# Altium schematic sheet theMonarchTransmitter.SchDoc: The Monarch Receiver
size A4; DrawnBy: Madison Beare
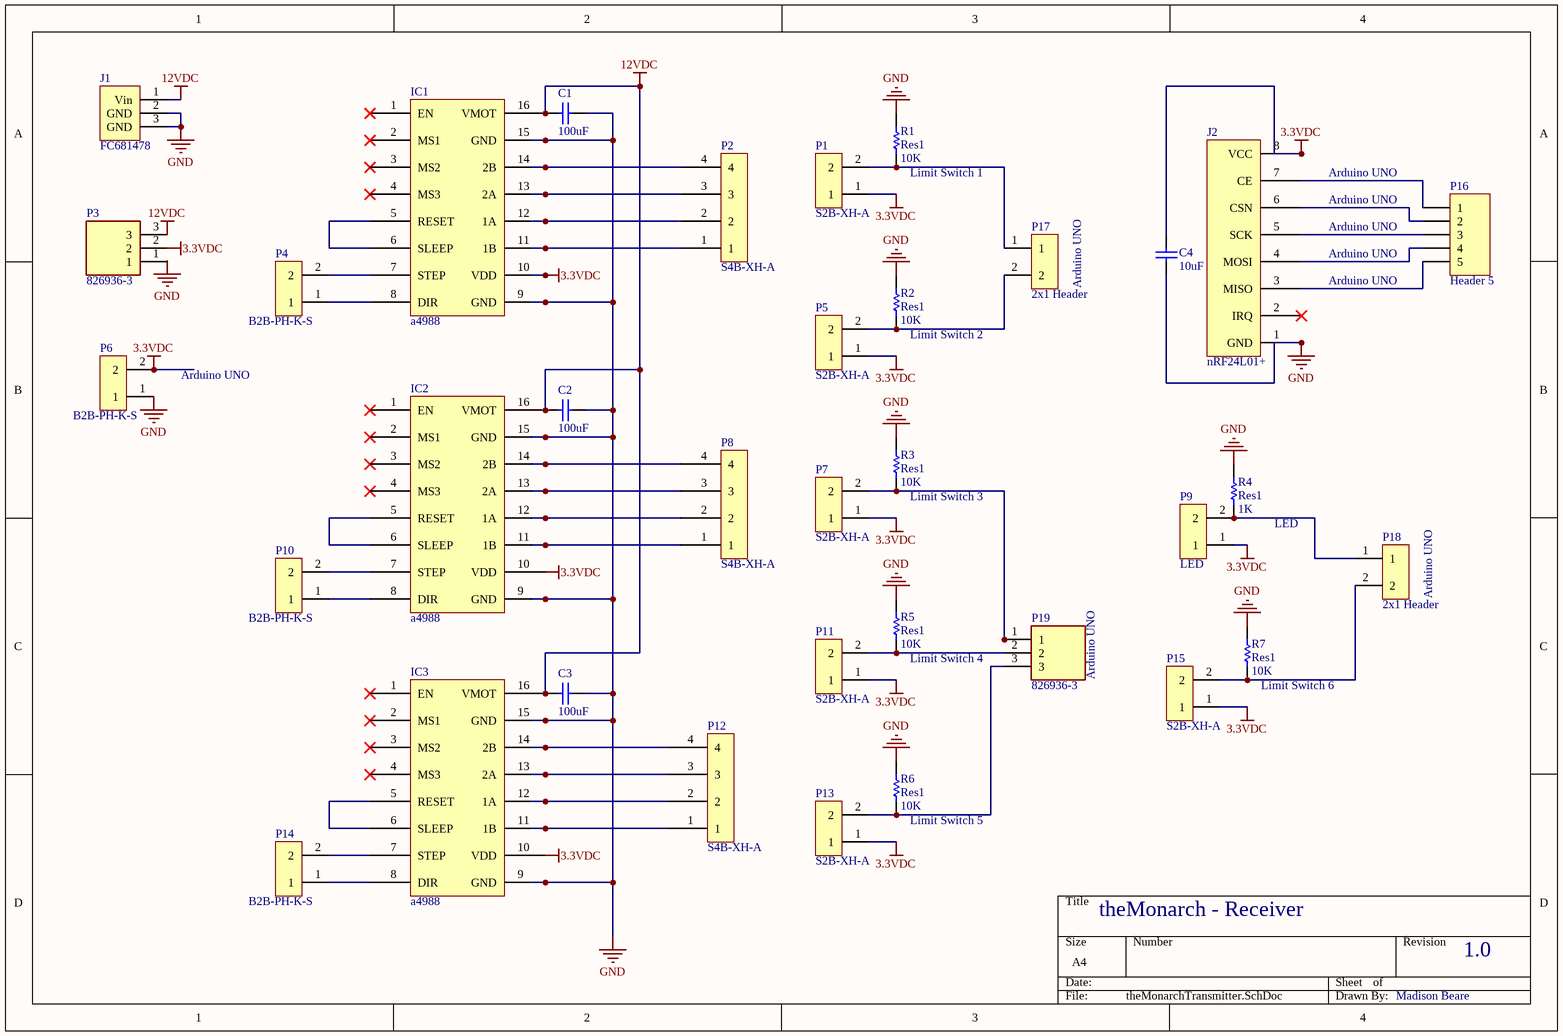
[diagram p0: theMonarchTransmitter.SchDoc]

## Parts
C1  100uF  [RAD-0.3]
C2  100uF  [RAD-0.3]
C3  100uF  [RAD-0.3]
C4  10uF  [RAD-0.3]
IC1  a4988  [MODULE_A4988_STEPPER_MOTOR_DRIVER_CARRIER]
IC2  a4988  [MODULE_A4988_STEPPER_MOTOR_DRIVER_CARRIER]
IC3  a4988  [MODULE_A4988_STEPPER_MOTOR_DRIVER_CARRIER]
J1  FC681478  [FC681478]
J2  nRF24L01+  [TE_5-146278-8]
P1  S2B-XH-A  [JST_S2B-XH-A(LF)(SN)]
P2  S4B-XH-A  [S4B-XH-A(LF)(SN)]
P3  826936-3  [TE_826936-3]
P4  B2B-PH-K-S  [JST_B2B-PH-K-S(LF)(SN)]
P5  S2B-XH-A  [JST_S2B-XH-A(LF)(SN)]
P6  B2B-PH-K-S  [JST_B2B-PH-K-S(LF)(SN)]
P7  S2B-XH-A  [JST_S2B-XH-A(LF)(SN)]
P8  S4B-XH-A  [S4B-XH-A(LF)(SN)]
P9  LED  [HDR1X2]
P10  B2B-PH-K-S  [JST_B2B-PH-K-S(LF)(SN)]
P11  S2B-XH-A  [JST_S2B-XH-A(LF)(SN)]
P12  S4B-XH-A  [S4B-XH-A(LF)(SN)]
P13  S2B-XH-A  [JST_S2B-XH-A(LF)(SN)]
P14  B2B-PH-K-S  [JST_B2B-PH-K-S(LF)(SN)]
P15  S2B-XH-A  [JST_S2B-XH-A(LF)(SN)]
P16  Header 5  [HDR1X5]
P17  2x1 Header  [JST_B2B-PH-K-S(LF)(SN)]
P18  2x1 Header  [JST_B2B-PH-K-S(LF)(SN)]
P19  826936-3  [TE_826936-3]
R1  Res1  value 10K  [AXIAL-0.3]
R2  Res1  value 10K  [AXIAL-0.3]
R3  Res1  value 10K  [AXIAL-0.3]
R4  Res1  value 1K  [AXIAL-0.3]
R5  Res1  value 10K  [AXIAL-0.3]
R6  Res1  value 10K  [AXIAL-0.3]
R7  Res1  value 10K  [AXIAL-0.3]

## Nets
3.3VDC: C4.2 IC1.10(VDD) IC2.10(VDD) IC3.10(VDD) J2.8(VCC) P1.1 P3.2 P5.1 P6.2 P7.1 P9.1 P11.1 P13.1 P15.1
12VDC: C1.1 C2.1 C3.1 IC1.16(VMOT) IC2.16(VMOT) IC3.16(VMOT) J1.1(Vin) P3.3
GND: C1.2 C2.2 C3.2 C4.1 IC1.9(GND) IC1.15(GND) IC2.9(GND) IC2.15(GND) IC3.9(GND) IC3.15(GND) J1.2(GND) J1.3(GND) J2.1(GND) P6.1 R1.2 R2.2 R3.2 R4.2 R5.2 R6.2 R7.2
NetIC1_5: IC1.5(RESET) IC1.6(SLEEP)
NetIC1_7: IC1.7(STEP) P4.2
NetIC1_8: IC1.8(DIR) P4.1
NetIC1_11: IC1.11(1B) P2.1
NetIC1_12: IC1.12(1A) P2.2
NetIC1_13: IC1.13(2A) P2.3
NetIC1_14: IC1.14(2B) P2.4
NetIC2_5: IC2.5(RESET) IC2.6(SLEEP)
NetIC2_7: IC2.7(STEP) P10.2
NetIC2_8: IC2.8(DIR) P10.1
NetIC2_11: IC2.11(1B) P8.1
NetIC2_12: IC2.12(1A) P8.2
NetIC2_13: IC2.13(2A) P8.3
NetIC2_14: IC2.14(2B) P8.4
NetIC3_5: IC3.5(RESET) IC3.6(SLEEP)
NetIC3_7: IC3.7(STEP) P14.2
NetIC3_8: IC3.8(DIR) P14.1
NetIC3_11: IC3.11(1B) P12.1
NetIC3_12: IC3.12(1A) P12.2
NetIC3_13: IC3.13(2A) P12.3
NetIC3_14: IC3.14(2B) P12.4
NetJ2_3: J2.3(MISO) P16.5
NetJ2_4: J2.4(MOSI) P16.4
NetJ2_5: J2.5(SCK) P16.3
NetJ2_6: J2.6(CSN) P16.2
NetJ2_7: J2.7(CE) P16.1
NetP1_2: P1.2 P17.1 R1.1
NetP5_2: P5.2 P17.2 R2.1
NetP7_2: P7.2 P19.1 R3.1
NetP9_2: P9.2 P18.1 R4.1
NetP11_2: P11.2 P19.2 R5.1
NetP13_2: P13.2 P19.3 R6.1
NetP15_2: P15.2 P18.2 R7.1

Not connected (* = marked no-connect by the designer): IC1 1(EN)* 2(MS1)* 3(MS2)* 4(MS3)*; IC2 1(EN)* 2(MS1)* 3(MS2)* 4(MS3)*; IC3 1(EN)* 2(MS1)* 3(MS2)* 4(MS3)*; J2 2(IRQ)*; P3 1

## Notes on the sheet
- (near R1) Limit Switch 1
- Arduino UNO
- (near P17) Arduino UNO
- (near R2) Limit Switch 2
- (near R3) Limit Switch 3
- LED
- (near P18) Arduino UNO
- (near R5) Limit Switch 4
- (near R7) Limit Switch 6
- (near R6) Limit Switch 5
- theMonarch - Receiver
- 1.0
- Madison Beare
- Labels drawn without touching a wire or pin: GND

## Library data of the parts
C1-C3 = Cap: Capacitor; Value: 100pF; Published: 8-Jun-2000; LatestRevisionDate: 17-Jul-2002; LatestRevisionNote: Re-released for DXP Platform.; PackageReference: RAD-0.3; Publisher: Altium Limited; PackageDescription: Radial Cap, Thru-Hole; 2 Leads; 0.3 in Pin Spacing
C4 = Cap: Capacitor; Published: 8-Jun-2000; LatestRevisionDate: 17-Jul-2002; LatestRevisionNote: Re-released for DXP Platform.; PackageReference: RAD-0.3; Publisher: Altium Limited; PackageDescription: Radial Cap, Thru-Hole; 2 Leads; 0.3 in Pin Spacing; Value: 10uF
J1 = FC681478: CLIFF ELECTRONIC COMPONENTS         FC681478            CONNECTOR, POWER ENTRY, RCPT, 2A, 16VDC; Gender: Male; Voltage Rating: 16V; Supplier 1: Farnell; Manufacturer: Cliff; Manufacturer Part Number: FC681478; RoHS: Yes; Category: Connectors; Stock 1: 534; Pricing 1: 1=1.94000, 50=0.87800, 100=0.78800, 250=0.70300, 500=0.66600, 1000=0.65500 (GBP); Mount: Through Hole; Color: Black; Termination: Through Hole; Current Rating: 2A; Orientation: Right Angle; Voltage Rating (DC): 16V; Length: 15.2mm; Width: 9mm; REACH SVHC: No SVHC; ComponentLink1URL: https://datasheet.ciiva.com/46428/1859070-46428805.pdf?src-supplier=Element14; ComponentLink1Description: https://datasheet.ciiva.com/46428/1859070-46428805.pdf?src-supplier=Element14; Supplier Part Number 1: 2450496
J2 = WRL-00691: SPARKFUN TRANSCEIVER BREAKOUT -; Frequency: 2.4GHz; Supplier 1: Digi-Key; Manufacturer: SparkFun; Manufacturer Part Number: WRL-00691; RoHS: No; Category: RF Semiconductors and Devices; Stock 1: 59; Pricing 1: 1=20.95000 (USD); ComponentLink1URL: https://github.com/sparkfun/Transceiver_Breakout-nRF24L01/tree/V_1.3?src-supplier=Digi-Key; ComponentLink1Description: https://github.com/sparkfun/Transceiver_Breakout-nRF24L01/tree/V_1.3?src-supplier=Digi-Key; Supplier Part Number 1: 1568-1295-ND
P1 P5 P7 P9 P11 P13 P15 P17 P18 = S2B-XH-A(LF)(SN): Conn Shrouded Header HDR 2 POS 2.5mm Solder RA Thru-Hole Box; Manufacturer: JST; Current Rating: 3A; Contact Resistance: 20mR; Voltage Rating (AC): 250V; Number of Positions: 2; Insulation Resistance: 1GR; Gender: Male; Connector Type: Male Pin; Wire/Cable Gauge: 22AWG; Supplier 1: Digi-Key; Manufacturer Part Number: S2B-XH-A(LF)(SN); RoHS: Yes; Category: Headers and Wire Housings; Stock 1: 54562; Pricing 1: 1=0.18000, 10=0.16800, 100=0.11710, 500=0.09904, 1000=0.08104, 5000=0.07204, 10000=0.06528 (USD); Mount: Through Hole; Contact Material: Brass; Contact Plating: Tin,Copper,Lead; Color: Natural; Housing Color: White; Housing Material: Polyamide; Min Operating Temperature: -25°C; Max Operating Temperature: 85°C; Number of Rows: 1; Voltage Rating: 250V; Termination: Press-Fit; Number of Contacts: 2; Orientation: Right Angle; Max Current Rating: 3A; Package Quantity: 1000; Packaging: Bulk; Max Voltage Rating (AC): 250V; Max Voltage Rating (DC): 250V; Length: 7.4mm; Pitch: 2.5mm; Lead Pitch: 2.5mm; Depth: 11.5mm; Lead Free: Lead Free; REACH SVHC: No SVHC; ComponentLink1URL: https://datasheet.ciiva.com/16208/s2b-xh-alfsn-16208978.pdf?src-supplier=Future+Electronics; ComponentLink1Description: https://datasheet.ciiva.com/16208/s2b-xh-alfsn-16208978.pdf?src-supplier=Future+Electronics; ComponentLink2URL: https://datasheet.ciiva.com/8052/1684882-8052211.pdf?src-supplier=Element14; ComponentLink2Description: https://datasheet.ciiva.com/8052/1684882-8052211.pdf?src-supplier=Element14; ComponentLink3URL: https://datasheet.ciiva.com/11746/0900766b8082f560-11746947.pdf?src-supplier=RSComponents; ComponentLink3Description: https://datasheet.ciiva.com/11746/0900766b8082f560-11746947.pdf?src-supplier=RSComponents; ComponentLink4URL: https://datasheet.ciiva.com/26924/getdatasheetpartid-645395-26924076.pdf?src-supplier=Verical; ComponentLink4Description: https://datasheet.ciiva.com/26924/getdatasheetpartid-645395-26924076.pdf?src-supplier=Verical; ComponentLink5URL: https://datasheet.ciiva.com/26894/getdatasheetpartid-640270-26894603.pdf?src-supplier=Verical; ComponentLink5Description: https://datasheet.ciiva.com/26894/getdatasheetpartid-640270-26894603.pdf?src-supplier=Verical; ComponentLink6URL: https://datasheet.ciiva.com/26894/getdatasheetpartid-441330-26894909.pdf?src-supplier=Verical; ComponentLink6Description: https://datasheet.ciiva.com/26894/getdatasheetpartid-441330-26894909.pdf?src-supplier=Verical; ComponentLink7URL: https://datasheet.ciiva.com/20207/523653-20207183.pdf?src-supplier=Rapid+Electronics; ComponentLink7Description: https://datasheet.ciiva.com/20207/523653-20207183.pdf?src-supplier=Rapid+Electronics; ComponentLink8URL: https://datasheet.ciiva.com/726/exh-726412.pdf?src-supplier=Digi-Key; ComponentLink8Description: https://datasheet.ciiva.com/726/exh-726412.pdf?src-supplier=Digi-Key; Supplier Part Number 1: 455-2257-ND
P2 P8 P12 = S4B-XH-A(LF)(SN): Conn Shrouded Header HDR 4 POS 2.5mm Solder RA Thru-Hole Box; Manufacturer: JST; Current Rating: 3A; Number of Positions: 4; Voltage Rating: 250V; Contact Resistance: 20mR; Insulation Resistance: 1GR; Gender: Male; Connector Type: Male Pin; Wire/Cable Gauge: 22AWG; Supplier 1: Digi-Key; Manufacturer Part Number: S4B-XH-A(LF)(SN); RoHS: Yes; Category: Headers and Wire Housings; Stock 1: 8950; Pricing 1: 1=0.27000, 10=0.25700, 100=0.17850, 500=0.15100, 1000=0.12355, 5000=0.10982, 10000=0.09953 (USD); Mount: Through Hole; Contact Material: Brass; Contact Plating: Tin,Lead,Copper; Color: Natural; Housing Color: White; Housing Material: Polyamide; Min Operating Temperature: -25°C; Max Operating Temperature: 85°C; Termination: Press-Fit; Orientation: Right Angle; Package Quantity: 500; Number of Rows: 1; Packaging: Bulk; Voltage Rating (AC): 250V; Max Current Rating: 3A; Number of Contacts: 4; Max Voltage Rating (AC): 250V; Length: 12.4mm; Pitch: 2.5mm; Lead Pitch: 2.5mm; Depth: 11.5mm; Lead Free: Lead Free; REACH SVHC: No SVHC; ComponentLink1URL: https://datasheet.ciiva.com/726/exh-726400.pdf?src-supplier=Digi-Key; ComponentLink1Description: https://datasheet.ciiva.com/726/exh-726400.pdf?src-supplier=Digi-Key; ComponentLink2URL: https://datasheet.ciiva.com/26924/getdatasheetpartid-449045-26924078.pdf?src-supplier=Verical; ComponentLink2Description: https://datasheet.ciiva.com/26924/getdatasheetpartid-449045-26924078.pdf?src-supplier=Verical; ComponentLink3URL: https://datasheet.ciiva.com/8052/5448-8052236.pdf?src-supplier=Element14; ComponentLink3Description: https://datasheet.ciiva.com/8052/5448-8052236.pdf?src-supplier=Element14; Supplier Part Number 1: 455-2243-ND
P3 P19 = 826936-3: Connector Header Through Hole 3 position 0.100 (2.54mm); MF: TE Connectivity; SnapEDA_Link: https://www.snapeda.com/parts/826936-3/TE%20Connectivity%20AMP%20Connectors/view-part/2390122/?ref=snap; MP: 826936-3; Value: *; Price: None; EU_RoHS_Compliance: Compliant; Package: None; Availability: Unavailable
P4 P6 P10 P14 = B2B-PH-K-S(LF)(SN): Connector Header, PH Series, 2 Position, 2.00mm, Through Hole, Press-Fit, Solder, Natural; Manufacturer: JST; Supplier 1: Digi-Key; Manufacturer Part Number: B2B-PH-K-S(LF)(SN); RoHS: Yes; Category: Connectors; Stock 1: 37001; Pricing 1: 1=0.17000, 10=0.16200, 100=0.10020, 500=0.08288, 1000=0.07252, 5000=0.06216, 10000=0.06044 (USD); Weight: 0.0625lb; Length: 0.2inch; Height: 0.35inch; Width: 0.24inch; ComponentLink1URL: http://www.farnell.com/datasheets/2057211.pdf?src-supplier=Farnell; ComponentLink1Description: http://www.farnell.com/datasheets/2057211.pdf?src-supplier=Farnell; ComponentLink2URL: http://www.farnell.com/datasheets/2057211.pdf?src-supplier=Newark; ComponentLink2Description: http://www.farnell.com/datasheets/2057211.pdf?src-supplier=Newark; ComponentLink3URL: http://www.farnell.com/datasheets/2057211.pdf?src-supplier=Element14; ComponentLink3Description: http://www.farnell.com/datasheets/2057211.pdf?src-supplier=Element14; Supplier Part Number 1: 455-1704-ND
P16 = Header 5: Header, 5-Pin; LatestRevisionDate: 17-Jul-2002; LatestRevisionNote: Re-released for DXP Platform.; Publisher: Altium Limited
R1-R7 = Res1: Resistor; Published: 8-Jun-2000; LatestRevisionDate: 17-Jul-2002; LatestRevisionNote: Re-released for DXP Platform.; PackageReference: AXIAL-0.3; Publisher: Altium Limited; PackageDescription: Axial Device, Thru-Hole; 2 Leads; 0.3 in Pin Spacing
IC1-IC3 = a4988: ComponentLink1Description: New link; ComponentLink1URL: *